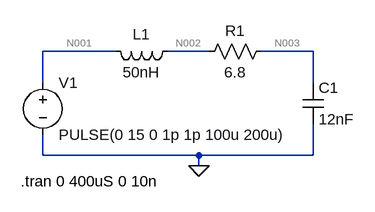
[diagram p0: schematic gatedrive_lessideal.asc]
gatedrive_lessideal.asc, the LTspice schematic file:
Version 4
SHEET 1 880 680
WIRE 192 96 80 96
WIRE 336 96 272 96
WIRE 496 96 416 96
WIRE 80 144 80 96
WIRE 496 144 496 96
WIRE 80 256 80 224
WIRE 320 256 80 256
WIRE 496 256 496 208
WIRE 496 256 320 256
WIRE 320 272 320 256
FLAG 320 272 0
SYMBOL voltage 80 128 R0
WINDOW 123 0 0 Left 0
WINDOW 39 0 0 Left 0
SYMATTR InstName V1
SYMATTR Value PULSE(0 15 0 1p 1p 100u 200u)
SYMBOL cap 480 144 R0
SYMATTR InstName C1
SYMATTR Value 12nF
SYMBOL ind 288 80 R90
WINDOW 0 5 56 VBottom 2
WINDOW 3 32 56 VTop 2
SYMATTR InstName L1
SYMATTR Value 50nH
SYMBOL res 432 80 R90
WINDOW 0 0 56 VBottom 2
WINDOW 3 32 56 VTop 2
SYMATTR InstName R1
SYMATTR Value 6.8
TEXT 46 296 Left 2 !.tran 0 400uS 0 10n

The netlist it stands for:
* gatedrive_lessideal.asc
V1 N001 0 PULSE(0 15 0 1p 1p 100u 200u)
C1 N003 0 12nF
L1 N002 N001 50nH
R1 N003 N002 6.8
.tran 0 400uS 0 10n
.backanno
.end

* Results of the author's LTspice run, read from the files saved beside the schematic
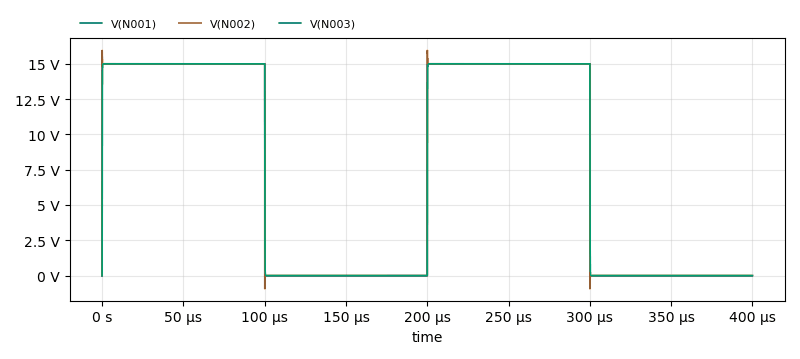
[diagram p1: Transient Analysis of gatedrive_lessideal.asc, plotted from the saved traces]
* Transient Analysis, 1 run:
*   V(N001): min 0 V, max 15 V, average 7.5 V, rms 10.61 V, last 0 V
*   V(N002): min -939 mV, max 15.95 V, average 7.5 V, rms 10.61 V, last 0 V
*   V(N003): min 0 V, max 15 V, average 7.5 V, rms 10.6 V, last 0 V